# Altium schematic sheet AUXILIARY POWER.SchDoc
size A3; CheckedBy: Alain.Zhu; CompanyName: TYMPHANY; DrawnBy: Yetta.He; Organization: PABU-BL3; Address1: 11F,block A, CEC building,; Address2: No.2070 Shennan Zhong road,; Address3: Huaqiang North, Futian District,; Address4: Shenzhen,  Guang Dong, P.R.C 518000; DocumentNumber: 4; Revision: 1.0.0; SheetNumber: 4; SheetTotal: 8; Size: A3; PCB By: Yetta.He; Status: DP1.1
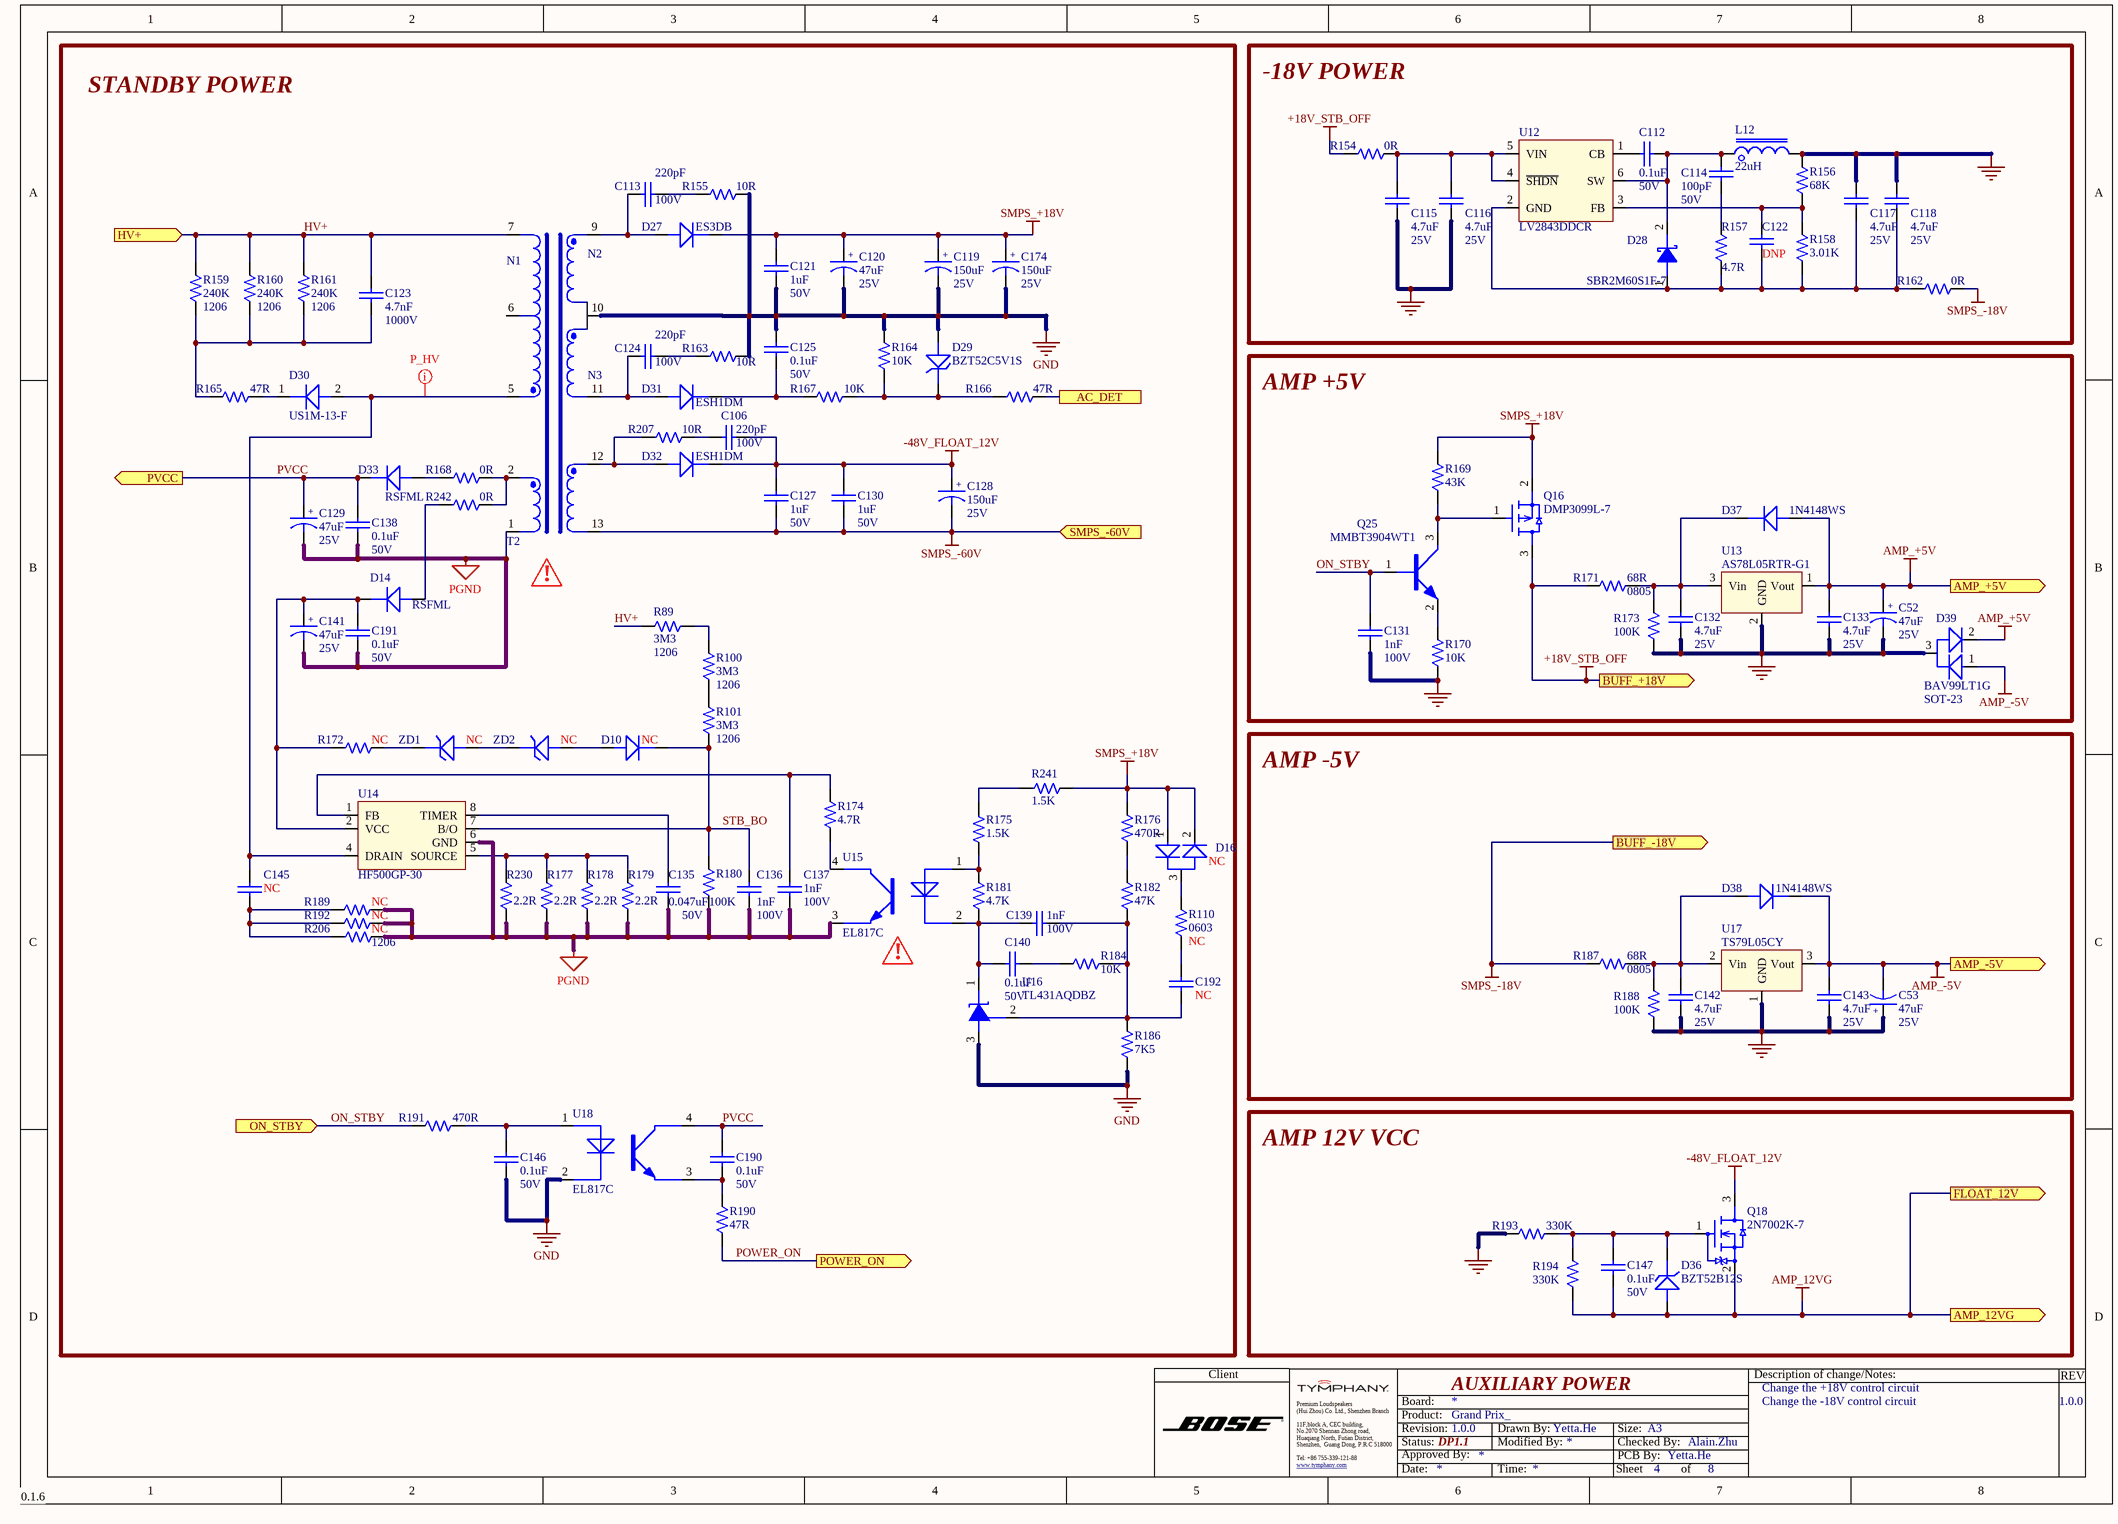
[diagram p0: AUXILIARY POWER.SchDoc]

## Parts
(Parts that share a designator on the sheet are numbered #1, #2 ... from top to bottom, then left to right.)
*?#1  Important Sign  (value not drawn)  (graphical)
*?#2  Important Sign  (value not drawn)  (graphical)
C52  value 47uF  Voltage: 25V  [CASE - D8]  (hidden comment: T551470445040)
C53  value 47uF  Voltage: 25V  [CASE - D8]  (hidden comment: T551470445040)
C106  value 220pF  Voltage: 100V  [CAPC0603-RW]  (hidden comment: PXL4564A0-2210)
C112  value 0.1uF  Voltage: 50V  [CAPC0603-RW]  (hidden comment: PXL456470-1040)
C113  value 220pF  Voltage: 100V  [CAPC0603-RW]  (hidden comment: PXL4564A0-2210)
C114  value 100pF  Voltage: 50V  [CAPC0603-RW]  (hidden comment: PXL410370-1010)
C115  value 4.7uF  Voltage: 25V  [CAPC0603-RW]  (hidden comment: T542024757408)
C116  value 4.7uF  Voltage: 25V  [CAPC0603-RW]  (hidden comment: T542024757408)
C117  value 4.7uF  Voltage: 25V  [CAPC0603-RW]  (hidden comment: T542024757408)
C118  value 4.7uF  Voltage: 25V  [CAPC0603-RW]  (hidden comment: T542024757408)
C119  value 150uF  Voltage: 25V  [CASE - F12]  (hidden comment: T551151445010)
C120  value 47uF  Voltage: 25V  [CASE - D8]  (hidden comment: T551470445040)
C121  value 1uF  Voltage: 50V  [CAPC0603-RW]  (hidden comment: T542021057508)
C122  value DNP  [CAPC0603-RW]  (hidden comment: CAP0603 NC)
C123  value 4.7nF  Voltage: 1000V  [CAPC1206-RW]  (hidden comment: PZL4564Q0-4720)
C124  value 220pF  Voltage: 100V  [CAPC0603-RW]  (hidden comment: PXL4564A0-2210)
C125  value 0.1uF  Voltage: 50V  [CAPC0603-RW]  (hidden comment: PXL456470-1040)
C127  value 1uF  Voltage: 50V  [CAPC0603-RW]  (hidden comment: T542021057508)
C128  value 150uF  Voltage: 25V  [CASE - F12]  (hidden comment: T551151445010)
C129  value 47uF  Voltage: 25V  [CASE - D8]  (hidden comment: T551470445040)
C130  value 1uF  Voltage: 50V  [CAPC0603-RW]  (hidden comment: T542021057508)
C131  value 1nF  Voltage: 100V  [CAPC0603-RW]  (hidden comment: PXL4564A2-1020)
C132  value 4.7uF  Voltage: 25V  [CAPC0603-RW]  (hidden comment: T542024757408)
C133  value 4.7uF  Voltage: 25V  [CAPC0603-RW]  (hidden comment: T542024757408)
C135  value 0.047uF  Voltage: 50V  [CAPC0603-RW]  (hidden comment: T54202473750)
C136  value 1nF  Voltage: 100V  [CAPC0603-RW]  (hidden comment: PXL4564A2-1020)
C137  value 1nF  Voltage: 100V  [CAPC0603-RW]  (hidden comment: PXL4564A2-1020)
C138  value 0.1uF  Voltage: 50V  [CAPC0603-RW]  (hidden comment: PXL456470-1040)
C139  value 1nF  Voltage: 100V  [CAPC0603-RW]  (hidden comment: PXL4564A2-1020)
C140  value 0.1uF  Voltage: 50V  [CAPC0603-RW]  (hidden comment: PXL456470-1040)
C141  value 47uF  Voltage: 25V  [CASE - D8]  (hidden comment: T551470445040)
C142  value 4.7uF  Voltage: 25V  [CAPC0603-RW]  (hidden comment: T542024757408)
C143  value 4.7uF  Voltage: 25V  [CAPC0603-RW]  (hidden comment: T542024757408)
C145  value NC  [CAPC1206-RW]  (hidden comment: PZL4564Q0-4720)
C146  value 0.1uF  Voltage: 50V  [CAPC0603-RW]  (hidden comment: PXL456470-1040)
C147  value 0.1uF  Voltage: 50V  [CAPC0603-RW]  (hidden comment: PXL456470-1040)
C174  value 150uF  Voltage: 25V  [CASE - F12]  (hidden comment: T551151445010)
C190  value 0.1uF  Voltage: 50V  [CAPC0603-RW]  (hidden comment: PXL456470-1040)
C191  value 0.1uF  Voltage: 50V  [CAPC0603-RW]  (hidden comment: PXL456470-1040)
C192  value NC  [CAPC0603-RW]  (hidden comment: CAP0603 NC)
D10  MFG Part: NC  [SOD-323]  (hidden comment: RCD114148-0020)
D14  MFG Part: RSFML  [subSMA]  (hidden comment: T571002670204)
D16  MFG Part: NC  [SOT23-132-RW]  (hidden comment: RCD100099-0010)
D27  MFG Part: ES3DB  [SMB]  (hidden comment: DIO ES3DB)
D28  MFG Part: SBR2M60S1F-7  [SOD-123]  (hidden comment: T572006161416)
D29  MFG Part: BZT52C5V1S  [SOD-323]  (hidden comment: T573004470941)
D30  RCD100010-0030  [SMA(DO-214AC)]  (value not drawn)
D31  T571002680204  [Micro SMA]  (value not drawn)
D32  T571002680204  [Micro SMA]  (value not drawn)
D33  MFG Part: RSFML  [subSMA]  (hidden comment: T571002670204)
D36  MFG Part: BZT52B12S  [SOD-323]  (hidden comment: T573004460941)
D37  RCD114148-0020  [SOD-323]  (value not drawn)
D38  RCD114148-0020  [SOD-323]  (value not drawn)
D39  Package: SOT-23  [SOT23-132-RW]  (hidden comment: RCD100099-0010)
L12  value 22uH  [IND CKST0505]  (hidden comment: T621000054100)
Q16  T585002550438  [SOT23-132-RW]  (value not drawn)
Q18  T586003230438  [SOT23-132-RW]  (value not drawn)
Q25  T581003992440  [SOT323(SC-70)-R]  (value not drawn)
R89  value 3M3  PACKAGE: 1206  [1206-RW]  (hidden comment: T502330404399)
R100  value 3M3  PACKAGE: 1206  [1206-RW]  (hidden comment: T502330404399)
R101  value 3M3  PACKAGE: 1206  [1206-RW]  (hidden comment: T502330404399)
R110  value NC  Package: 0603  [0603-RW]  (hidden comment: RES0603 NC)
R154  value 0R  [0805-RW]  (hidden comment: T502000003009)
R155  value 10R  [0603-RW]  (hidden comment: QCF011030-1009)
R156  value 68K  [0603-RW]  (hidden comment: QCF011030-6802)
R157  value 4.7R  [0603-RW]  (hidden comment: QCF011030-4708)
R158  value 3.01K  [0603-RW]  (hidden comment: QCF011030-3011)
R159  value 240K  PACKAGE: 1206  [1206-RW]  (hidden comment: T502240304399)
R160  value 240K  PACKAGE: 1206  [1206-RW]  (hidden comment: T502240304399)
R161  value 240K  PACKAGE: 1206  [1206-RW]  (hidden comment: T502240304399)
R162  value 0R  [0805-RW]  (hidden comment: T502000003009)
R163  value 10R  [0603-RW]  (hidden comment: QCF011030-1009)
R164  value 10K  [0603-RW]  (hidden comment: QCF011030-1002)
R165  value 47R  [0805-RW]  (hidden comment: QCF081020-4709)
R166  value 47R  [0603-RW]  (hidden comment: QCF011030-4709)
R167  value 10K  [0603-RW]  (hidden comment: QCF011030-1002)
R168  value 0R  [0805-RW]  (hidden comment: T502000003009)
R169  value 43K  [0603-RW]  (hidden comment: QCF011031-4302)
R170  value 10K  [0603-RW]  (hidden comment: QCF011030-1002)
R171  value 68R  PACKAGE: 0805  [0805-RW]  (hidden comment: QCF081020-6809)
R172  value NC  [0603-RW]  (hidden comment: RES0603 NC)
R173  value 100K  [0603-RW]  (hidden comment: QCF011030-1003)
R174  value 4.7R  [0805-RW]  (hidden comment: QCF081020-4708)
R175  value 1.5K  [0603-RW]  (hidden comment: QCF011030-1501)
R176  value 470R  [0603-RW]  (hidden comment: QCF011030-4700)
R177  value 2.2R  [0805-RW]  (hidden comment: QCF081020-2208)
R178  value 2.2R  [0805-RW]  (hidden comment: QCF081020-2208)
R179  value 2.2R  [0805-RW]  (hidden comment: QCF081020-2208)
R180  value 100K  [0603-RW]  (hidden comment: QCF011030-1003)
R181  value 4.7K  [0603-RW]  (hidden comment: QCF011030-4701)
R182  value 47K  [0603-RW]  (hidden comment: QCF011030-4702)
R184  value 10K  [0603-RW]  (hidden comment: QCF011030-1002)
R186  value 7K5  [0603-RW]  (hidden comment: QCF011030-7501)
R187  value 68R  PACKAGE: 0805  [0805-RW]  (hidden comment: QCF081020-6809)
R188  value 100K  [0603-RW]  (hidden comment: QCF011030-1003)
R189  value NC  [1206-RW]  (hidden comment: QCF041010-4709)
R190  value 47R  [0603-RW]  (hidden comment: QCF011030-4709)
R191  value 470R  [0603-RW]  (hidden comment: QCF011030-4700)
R192  value NC  [1206-RW]  (hidden comment: QCF041010-4709)
R193  value 330K  [0603-RW]  (hidden comment: QCF011030-3303)
R194  value 330K  [0603-RW]  (hidden comment: QCF011030-3303)
R206  value NC  PACKAGE: 1206  [1206-RW]  (hidden comment: QCF041010-4709)
R207  value 10R  [0603-RW]  (hidden comment: QCF011030-1009)
R230  value 2.2R  [0805-RW]  (hidden comment: QCF081020-2208)
R241  value 1.5K  [0603-RW]  (hidden comment: QCF011030-1501)
R242  value 0R  [0805-RW]  (hidden comment: T502000003009)
T2  TRANS HTS-EEL25A  [HTS-EEL25A]  (value not drawn)
U12  MFG Part: LV2843DDCR  [DBV(R-PDSO-G6)]  (hidden comment: RCI002843-0001)
U13  T610600095267  [SOT89]  (value not drawn)
U14  HF500GP-30  [DIP-8C]
U15  MFG Part: EL817C  [EL817-S1]  (hidden comment: RCI000817-0001)
U16  MFG Part: TL431AQDBZ  [SOT23-132-RW]  (hidden comment: T610600097805)
U17  T610600095171  [SOT89]  (value not drawn)
U18  MFG Part: EL817C  [EL817-S1]  (hidden comment: RCI000817-0001)
ZD1  MFG Part: NC  [SOD-323]  (hidden comment: T573004530741)
ZD2  MFG Part: NC  [SOD-323]  (hidden comment: T573004530741)

## Blocks framed on the sheet
STANDBY POWER: *?#1 *?#2 C106 C113 C119-C121 C123-C125 C127-C130 C135-C141 C145 C146 C174 C190-C192 D10 D14 D16 D27 D29-D33 R89 R100 R101 R110 R155 R159-R161 R163-R168 R172 R174-R182 R184 R186 R189-R192 R206 R207 R230 R241 R242 T2 U14-U16 U18 ZD1 ZD2
-18V POWER: C112 C114-C118 C122 D28 L12 R154 R156-R158 R162 U12
AMP +5V: C52 C131-C133 D37 D39 Q16 Q25 R169-R171 R173 U13
AMP -5V: C53 C142 C143 D38 R187 R188 U17
AMP 12V VCC: C147 D36 Q18 R193 R194

## Ports
AC_DET, AMP_12VG (out), AMP_+5V (out), AMP_-5V (out), BUFF_+18V (out), BUFF_-18V (out), FLOAT_12V (out), HV+ (in), ON_STBY (in), POWER_ON (out), PVCC (out), SMPS_-60V (in)

## Nets
+18V_STB_OFF: Q16.3(D) R154.1 R171.2 ; port BUFF_+18V
-48V_FLOAT_12V: C106.1 C127.1 C128.1 C130.1 D32.2(K) Q18.3(D)
AMP_12VG: C147.2 D36.1(A) Q18.2(S) R194.1 ; port AMP_12VG, port FLOAT_12V
AMP_+5V: C52.1 C133.1 D37.1(A) D39.2(A) U13.1(Vout) ; port AMP_+5V
AMP_-5V: C53.2 C143.1 D38.2(K) D39.1(A) U17.3(Vout) ; port AMP_-5V
GND: C52.2 C53.1 C115.2 C116.2 C117.1 C118.1 C119.2 C120.2 C121.2 C125.1 C131.2 C132.2 C133.2 C142.2 C143.2 C146.2 C174.2 D29.1(A) D39.3(K) L12.2 R155.2 R156.2 R163.2 R164.2 R170.1 R173.1 R186.1 R188.1 R193.2 T2.10 U13.2(GND) U16.3(A) U17.1(GND) U18.2(E)
PGND: C129.2 C135.2 C136.2 C137.2 C138.2 C141.2 C191.2 R177.1 R178.1 R179.1 R180.1 R189.1 R192.1 R206.2 R230.1 T2.1 U14.6(GND) U15.3(C)
SMPS_+18V: C119.1 C120.1 C121.1 C174.1 D16.1(A) D16.2(A) D27.2(K) Q16.2(S) R169.2 R176.2 R241.2
SMPS_-18V: R162.2 R187.2 ; port BUFF_-18V
SMPS_-60V: C127.2 C128.2 C130.2 T2.13 ; port SMPS_-60V
AC_DET: R166.2 ; port AC_DET
HV+: C123.1 R89.2 R159.2 R160.2 R161.2 T2.7 ; port HV+
ON_STBY: C131.1 Q25.1(B) R191.2 ; port ON_STBY
POWER_ON: R190.1 ; port POWER_ON
PVCC: C129.1 C138.1 C190.1 D33.2(K) U18.4(C) ; port PVCC
STB_BO: C136.1 D10.2(K) R101.1 R180.2 U14.7(B/O)
NetC106_2: C106.2 R207.2
NetC112_1: C112.1 U12.1(CB)
NetC112_2: C112.2 C114.2 D28.2(K) L12.1 U12.6(SW)
NetC113_1: C113.1 R155.1
NetC113_2: C113.2 D27.1(A) T2.9
NetC114_1: C114.1 R157.2
NetC115_1: C115.1 C116.1 R154.2 U12.4(~{SHDN}) U12.5(VIN)
NetC117_2: C117.2 C118.2 C122.2 D28.1(A) R157.1 R158.1 R162.1 U12.2(GND)
NetC122_1: C122.1 R156.1 R158.2 U12.3(FB)
NetC123_2: C123.2 R159.1 R160.1 R161.1 R165.2
NetC124_1: C124.1 R163.1
NetC124_2: C124.2 D31.1(A) T2.11
NetC125_2: C125.2 D31.2(K) R167.2
NetC132_1: C132.1 D37.2(K) R171.1 R173.2 U13.3(Vin)
NetC135_1: C135.1 U14.8(TIMER)
NetC137_1: C137.1 R174.2 U14.1(FB)
NetC139_1: C139.1 C140.1 R181.1 U15.2(E) U16.1(K)
NetC139_2: C139.2 C192.2 R182.1 R184.1 R186.2 U16.2(R)
NetC140_2: C140.2 R184.2
NetC141_1: C141.1 C191.1 D14.2(K) R172.1 U14.2(VCC)
NetC142_1: C142.1 D38.1(A) R187.1 R188.2 U17.2(Vin)
NetC145_1: C145.1 R189.2 R192.2 R206.1
NetC145_2: C145.2 D30.2(K) T2.5 U14.4(DRAIN)
NetC146_1: C146.1 R191.1 U18.1(B)
NetC147_1: C147.1 D36.2(K) Q18.1(G) R193.1 R194.2
NetC190_2: C190.2 R190.2 U18.3(C)
NetC192_1: C192.1 R110.1
NetD10_1: D10.1(A) ZD2.1(A)
NetD14_1: D14.1(A) R242.1
NetD16_3: D16.3(K) R110.2
NetD29_2: D29.2(K) R164.1 R166.1 R167.1
NetD30_1: D30.1(A) R165.1
NetD32_1: D32.1(A) R207.1 T2.12
NetD33_1: D33.1(A) R168.1
NetQ16_1: Q16.1(G) Q25.3(C) R169.1
NetQ25_2: Q25.2(E) R170.2
NetR89_1: R89.1 R100.2
NetR100_1: R100.1 R101.2
NetR168_2: R168.2 R242.2 T2.2
NetR172_2: R172.2 ZD1.2(K)
NetR174_1: R174.1 U15.4(C)
NetR175_1: R175.1 R241.1
NetR175_2: R175.2 R181.2 U15.1(B)
NetR176_1: R176.1 R182.2
NetR177_2: R177.2 R178.2 R179.2 R230.2 U14.5(SOURCE)
NetZD1_1: ZD1.1(A) ZD2.2(K)

Not connected (* = marked no-connect by the designer): T2 6

## Layout directives
net class P_HV: NetC145_2

## Notes on the sheet
- AUXILIARY POWER
- Change the +18V control circuit
- Change the -18V control circuit
- 0.1.6
- Client
- Description of change/Notes:
- REV
- Premium Loudspeakers
- (Hui Zhou) Co. Ltd., Shenzhen Branch
- Tel: +86 755-339-121-88
- Board:
- Status:
- Revision:
- Product:
- Approved By:
- Grand Prix_
- Drawn By:
- Modified By:
- Checked By:
- PCB By:
- Size:
- www.tymphany.com <http://www.tymphany.com>
- Date:
- Time:
- Sheet
- of
- (in symbol CAP E 47UF 25V +-20%_OVK470M1ETR-0608CS) +
- (in symbol CAP E 150UF 25V +-20%_OVK151M1ETR-0812CS) +
- (in symbol Important Sign) !
- (in symbol TRANS HTS-EEL25A) N2; N1; N3

## Library data of the parts
C52 C53 C120 C129 C141 = CAP E 47UF 25V +-20%_OVK470M1ETR-0608CS: E 47UF 25V +-20% 6X8MM OVK470M1E K; MFG: LELON; Tolerance: 20%; Type: Capacitor; CREATE_NAME: Cherry; DIP&SMD: SMD; SAP: T551470445040; PACKAGE: CASE - C7.7; Vendor Name: *; Vendor Code: *; MFG Part: OVK470M1ETR-0608CS; Other: *; CREATE_TIME: 2019-04-02; Customer Specific: N/A
C106 C113 C124 = CAP0603 220pF 100V 10%: CHIP CAP 220pF 100V 10%; SAP: T542022217608; Vendor Code: 10010262; Vendor Name: 东莞市晴远电子有限公司; Type: Capacitor; DIP&SMD: SMD; PACKAGE: CAPC0603; MFG: *; MFG Part: *; Other: *; Tolerance: 10%; Customer Specific: N/A
C112 C125 C138 C140 C146 C147 C190 C191 = CAP0603 0.1uF 50V 10% - PXL456470-1040: GP CHIP CAP 0.1uF 50V 10% 0603 TYPE X7R; SAP: T542021047508; Vendor Code: 10010262; Vendor Name: 东莞市晴远电子有限公司; Type: Capacitor; DIP&SMD: SMD; PACKAGE: CAPC0603; MFG: *; MFG Part: *; Other: X7R; Tolerance: 10%; Customer Specific: N/A
C114 = CAP0603 100pF 50V 5% - PXL410370-1010: GP CHIP CAP 100pF 50V 5% 0603 TYPE NPO; SAP: T541021016508; Vendor Code: 10010262; Vendor Name: 东莞市晴远电子有限公司; Type: Capacitor; DIP&SMD: SMD; PACKAGE: CAPC0603; MFG: *; MFG Part: *; Other: NPO; Tolerance: 5%; Customer Specific: N/A
C115-C118 C132 C133 C142 C143 = CAP0603 4.7uF 25V 10%_X7R_WALSIN: CAP X7R 4.7UF 25V +-10% 0603 WALSIN L; Tolerance: 10%; Type: Capacitor; CREATE_NAME: Nathan; DIP&SMD: SMD; SAP: T542024757408; PACKAGE: CAPC0603; Vendor Name: *; MFG: WALSIN; MFG Part: *; Other: X7R; CREATE_TIME: 13-July-2016; Customer Specific: N/A
C119 C128 C174 = CAP E 150UF 25V +-20%_OVK151M1ETR-0812CS: E 150UF 25V +-20% 8X12MM OVK151M1E K; MFG: lelon; Tolerance: 20%; Type: Capacitor; DIP&SMD: SMD; CREATE NAME: Cherry; SAP: T551151445010; PACKAGE: CASE - F12; Vendor Name: *; Vendor Code: *; MFG Part: OVK151M1ETR-0812CS; Other: *; Customer Specific: N/A; CREATE TIME: 2019-04-02
C121 = CAP0603 1uF 50V 10%_X7R_WALSIN: CAP X7R 1.0UF 50V +-10% 0603 WALSIN L; Tolerance: 10%; Type: Capacitor; CREATE_NAME: Nathan; DIP&SMD: SMD; SAP: T542021057508; PACKAGE: CAPC0603; Vendor Name: *; MFG: WALSIN; MFG Part: *; Other: X7R; CREATE_TIME: 13-July-2016; Customer Specific: N/A
C122 C192 = CAP0603 NC: NC; Type: Capacitor; CREATE_NAME: Tom; DIP&SMD: SMD; SAP: *; PACKAGE: CAPC0603; Vendor Code: *; Vendor Name: *; MFG: *; MFG Part: *; Other: *; Tolerance: *; CREATE_TIME: 18-Mar-2016; Voltage: *; Customer Specific: N/A
C123 C145 = CAP1206 4.7nF 1000V 10%: CHIP CAP 4.7nF 1000V 10% 1206; SAP: T542044727H08; Vendor Code: 10010262; Vendor Name: ¶«Ý¸ÊÐÇçÔ¶µç×ÓÓÐÏÞ¹«Ë¾; Type: Capacitor; DIP&SMD: SMD; PACKAGE: CAPC1206; MFG: *; MFG Part: *; Other: *; Tolerance: 10%; Customer Specific: N/A
  C145: Voltage: 1000V
C127 C130 = CAP0603 1uF 50V 10%_X7R_WALSIN: CAP X7R 1.0UF 50V +-10% 0603 WALSIN L; Tolerance: 10%; Type: Capacitor; DIP&SMD: SMD; CREATE_NAME: Nathan; SAP: T542021057508; PACKAGE: CAPC0603; Vendor Name: *; MFG: WALSIN; MFG Part: *; Other: X7R; Customer Specific: N/A; CREATE_TIME: 13-July-2016
C131 C136 C137 C139 = CAP0603 1nF 100V 10% - PXL4564A2-1020: CHIP CAP 1nF 100V 10%; SAP: T542021027608; Vendor Code: 10010262; Vendor Name: 东莞市晴远电子有限公司; Type: Capacitor; DIP&SMD: SMD; PACKAGE: CAPC0603; MFG: *; MFG Part: *; Other: *; Tolerance: 10%; Customer Specific: N/A
C135 = CAP0603 0.047uF 50V 10%_X7R_SAMSUNG: CAP X7R .047U 50V +-10% 0603 SAMSUN L; SAP: T542024737508; Tolerance: 10%; Type: Capacitor; CREATE_NAME: Nathan; DIP&SMD: SMD; PACKAGE: CAPC0603; Vendor Code: *; Vendor Name: *; MFG: SAMSUNG; MFG Part: *; Other: X7R; CREATE_TIME: 02-Aug-2016; Customer Specific: N/A
D10 D37 D38 = 1N4148WS: DIODE SW 1N4148 VF=0.7V SOD-323; MFG: TW SEMICONDUCTOR; SAP: T572005070208; Voltage: 100V; Current: 150MA; DIP&SMD: SMD; Vendor Name: *; Vendor Code: *; Type: DIODE; Customer Specific: N/A; Package: SOD-323
  D37 D38: MFG Part: 1N4148WS
D14 D33 = DIO RSFML: DIODE 1000 0.8A RSFML TSC K; MFG: TSC    (台灣半導體); Voltage: 1000V; CREATE_NAME: Tom; DIP&SMD: SMD; SAP: T571002670204; Current: 0.8A; Type: DIODE; CREATE_TIME: 25-Nov-2016; Package: sub-SMA; Customer Specific: N/A
D16 D39 = BAV99LT1G: SWITC 70V 215MA BAV99LT1G ON SE G; SAP: T572003550122; MFG: ON SEMI; Voltage: 100V; Power: 225MW; Type: DIODE; DIP&SMD: SMD; Vendor Code: *; Vendor Name: *; Current: 215mA; Customer Specific: N/A
  D16: Package: SOT-23
  D39: MFG Part: BAV99LT1G
D27 = DIO ES3DB: CHIP DIODE DO-214AA(SMB) ES3DB; MFG: TW SEMICONDUCTOR; SAP: T570000980812; I fsm: 100A; CREATE_NAME: Nathan; DIP&SMD: SMD; I f(av): 3A; Vendor Name: *; Vendor Code: *; Type: DIODE; Package: DO-214AA(SMB); CREATE_TIME: 07-Nov-2018; Customer Specific: N/A
D28 = DIO SBR2M60S1F-7: SWITC 0.7V 2A SBR2M60S1F-7 DIODE L; MFG: DIODES; Voltage: 50V; Current: 5.0A; DIP&SMD: SMD; CREATE_NAME: Nathan; SAP: T572006161416; Vendor Name: *; Vendor Code: *; Type: DIODE; Customer Specific: N/A; Package: SOD123F; CREATE_TIME: 16-Mar-2017
D29 = BZT52C5V1S_TSC: ZD 5.1V 200MW ±5% SMD TSC ( K; MFG: TSC (TAIWAN SEMICONDUCTOR); VOLTAGE: 5V1; Type: ZENER; CREATE_NAME: Nathan; SAP: T573004470941; Vendor Code: *; Vendor Name: *; Current: *; Tolerance: 5%; Power: 200MW; DIP&SMD: SMD; Customer Specific: N/A; Package: SOD-323F; CREATE_TIME: 15-Mar-2019
D30 = US1M-13-F: DIODE 1000 1.0A US1M-13-F DIODE K; MFG: DIODES  (ZETEX); SAP: T571002110230; DIP&SMD: SMD; CREATE_NAME: Nathan; Voltage: *; Type: DIODE; Customer Specific: N/A; MFG Part: US1M-13-F; CREATE_TIME: 10-Aug-2017
D31 = ESH1DM: DIODE 200V 1.0A ESH1DM TSC G; Current: 1A; CREATE_NAME: Tom; MFG: TSC; SAP: T571002680204; Vendor Name: *; Vendor Code: *; Voltage: 200V; Type: DIODE; CREATE_TIME: 19-Jul-2016; Package: Micro SMA; MFG Part: ESH1DM
D32 = ESH1DM: DIODE 200V 1.0A ESH1DM TSC G; Current: 1A; CREATE_NAME: Tom; DIP&SMD: SMD; MFG: TSC; SAP: T571002680204; Vendor Name: *; Vendor Code: *; Voltage: 200V; Type: DIODE; CREATE_TIME: 19-Jul-2016; Package: Micro SMA; Customer Specific: N/A; MFG Part: ESH1DM
D36 = BZT52B12S_TSC: ZD 12V 200MW ±2% SMD TSC ( K; MFG: TSC (TAIWAN SEMICONDUCTOR); Type: ZENER; CREATE_NAME: Nathan; SAP: T573004460941; Vendor Code: *; Vendor Name: *; Current: *; Tolerance: 2%; Power: 200MW; VOLTAGE: 12V; Package: SOD-323F; CREATE_TIME: 15-Mar-2019; DIP&SMD: SMD; Customer Specific: N/A
L12 = IND 22uH CKST0505-22UH\M: 22UH 2 5A 100K 5.7X CENKER CKST050 K; Type: INDUCTOR; CREATE_NAME: Nathan; Irms: 1.5A; DCR: 238mΩ; Isat: 2.5A; DIP&SMD: SMD; SAP: T621000054100; MFG: CENKER; Vendor Code: *; Vendor Name: *; CREATE_TIME: 27-Dec-2017; MFG Part: CKST0505-22UH\M
Q16 = DMP3099L-7: PMOS 20V DMP3099L-7 SOT23 DIODES K; MFG: DIODES  (ZETEX); CREATE_NAME: Nathan; DIP&SMD: SMD; SAP: T585002550438; Vendor Code: *; Vendor Name: *; Power: *; Voltage: *; Type: PMOS; Package: SOT-23; CREATE_TIME: 25-Nov-2018; Customer Specific: N/A; MFG Part: DMP3099L-7
Q18 = 2N7002K-7: NMOS 60V 2N7002K-7 SOT23 DIODES K; MFG: DIODES  (ZETEX); Type: N-CHANNEL MOSFET; CREATE_NAME: Nathan; DIP&SMD: SMD; SAP: T586003230438; Power: *; Vendor Code: *; Vendor Name: *; Voltage: 60V; CREATE_TIME: 27-Sep-2018; Customer Specific: N/A; Package: SOT-23; MFG Part: 2N7002K-7
Q25 = MMBT3904WT1: NPN 40V MMBT3904WT1 SC70 ( ON K; CREATE_NAME: Nathan; DIP&SMD: SMD; SAP: T581003992440; MFG: ON; Vendor Code: *; Vendor Name: *; Voltage: *; Type: NPN; CREATE_TIME: 17-Oct-2017; Current: *; Customer Specific: N/A; MFG Part: MMBT3904WT1
R89 R100 R101 = RES1206 1/4W 1% 3.3M OHM_WALSIN: CHIP 3.3M OHM  100PPM +-1% 1206 WALS L; Power: 1/4W; MFG: WALSIN (華新); TOL: 1%; CREATE_NAME: Nathan; DIP&SMD: SMD; Vendor Code: *; SAP: T502330404399; Vendor Name: *; MFG Part: *; Type: Resistor; CREATE_TIME: 03-July-2016; Customer Specific: N/A
R110 R172 = RES0603 NC: NC; CREATE_NAME: Tom; DIP&SMD: SMD; SAP: *; Tolerance: *; MFG Part: *; MFG: *; Vendor Code: *; Vendor Name: *; Type: Resistor; Power: *; CREATE_TIME: 18-Mar-2016; Customer Specific: N/A
  R172: Package: 0603
R154 R162 R168 R242 = RES0805 1/8W  0 OHM_WALSIN: CHIP 0 OHM 0 OHM 0 OHM 0805 WALSI L; Power: 1/8W; MFG: WALSIN; CREATE_Name: Tom; DIP&SMD: SMD; Vendor Code: *; SAP: T502000003009; Vendor Name: *; MFG Part: *; TOL: *; Type: Resistor; CREATE_Time: 27-Jun-2018; PACKAGE: 0805; Customer Specific: N/A
R155 R163 R207 = RES0603 1/10W 1% 10 OHM: CHIP 10 OHM 100PPM +-1% 0603 WALS L; Vendor Code: 10010262; SAP: T502100A02399; Power: 1/10W; Vendor Name: 东莞市晴远电子有限公司; MFG: WALSIN (華新); TOL: 1%; DIP&SMD: SMD; MFG Part: *; Type: Resistor; PACKAGE: 0603; Customer Specific: N/A
R156 = RES0603 1/10W 1% 68K OHM: GP CHIP RES. 68K OHM 1/10W 1% 0603; Vendor Code: 10010262; SAP: T502680202399; Vendor Name: 东莞市晴远电子有限公司; DIP&SMD: SMD; Power: 1/10W; MFG Part: *; MFG: *; TOL: 1%; Type: Resistor; PACKAGE: 0603; Customer Specific: N/A
R157 = RES0603 1/10W 1% 4.7 OHM: CHIP RES. 4.7 OHM 1/10W 1% 0603; Vendor Code: 10010262; SAP: T502470B02399; Vendor Name: 东莞市晴远电子有限公司; DIP&SMD: SMD; Power: 1/10W; MFG Part: *; MFG: *; TOL: 1%; Type: Resistor; PACKAGE: 0603; Customer Specific: N/A
R158 = RES0603 1/10W 1% 3.01K OHM: CHIP RES 3.01K OHM 1% 1/10W  0603; SAP: T502301102399; CREATE_NAME: TOM@Deftronics; DIP&SMD: SMD; Vendor Code: *; Power: 1/10W; Vendor Name: *; MFG: *; MFG Part: *; TOL: 1%; Type: Resistor; CREATE_TIME: 21-Nov-2013; PACKAGE: 0603; Customer Specific: N/A
R159-R161 = RES1206 1/4W 1% 240K OHM_WALSIN: CHIP 240K OHM  100PPM +-1% 1206 WALS L; Power: 1/4W; MFG: WALSIN (ÈAÐÂ); TOL: 1%; CREATE_NAME: Nathan; DIP&SMD: SMD; Vendor Code: *; SAP: T502240304399; Vendor Name: *; MFG Part: *; Type: Resistor; CREATE_TIME: 03-July-2016; Customer Specific: N/A
R164 R167 = RES0603 1/10W 1% 10K OHM: GP CHIP RES. 10K OHM 1/10W 1% 0603; Vendor Code: 10010262; SAP: T502100202399; Vendor Name: ¶«Ý¸ÊÐÇçÔ¶µç×ÓÓÐÏÞ¹«Ë¾; DIP&SMD: SMD; Power: 1/10W; MFG Part: *; MFG: *; TOL: 1%; Type: Resistor; PACKAGE: 0603; Customer Specific: N/A
R165 = RES0805 1/8W 1% 47 OHM: GP CHIP RES. 47 OHM 1/8W 1% 0805; Vendor Code: 10010262; SAP: T502470A03399; Vendor Name: 东莞市晴远电子有限公司; DIP&SMD: SMD; Power: 1/8W; MFG Part: *; MFG: *; TOL: 1%; Type: Resistor; PACKAGE: 0805; Customer Specific: N/A
R166 R190 = RES0603 1/10W 1% 47 OHM: GP CHIP RES. 47 OHM 1/10W 1% 0603; Vendor Code: 10010262; SAP: T502470A02399; Vendor Name: 东莞市晴远电子有限公司; DIP&SMD: SMD; Power: 1/10W; MFG Part: *; MFG: *; TOL: 1%; Type: Resistor; PACKAGE: 0603; Customer Specific: N/A
R169 = RES0603 1/10W 1% 43K OHM: CHIP RES. 43K OHM 1/10W 1% 0603; Vendor Code: 10010262; SAP: T502430202399; Vendor Name: 东莞市晴远电子有限公司; DIP&SMD: SMD; Power: 1/10W; MFG Part: *; MFG: *; TOL: 1%; Type: Resistor; PACKAGE: 0603; Customer Specific: N/A
R170 R184 = RES0603 1/10W 1% 10K OHM: GP CHIP RES. 10K OHM 1/10W 1% 0603; Vendor Code: 10010262; SAP: T502100202399; Vendor Name: 东莞市晴远电子有限公司; DIP&SMD: SMD; Power: 1/10W; MFG Part: *; MFG: *; TOL: 1%; Type: Resistor; PACKAGE: 0603; Customer Specific: N/A
R171 R187 = RES0805 1/8W 1% 68 OHM: GP CHIP RES. 68 OHM 1/8W 1% 0805; SAP: T502680A03399; MFG: WALSIN; DIP&SMD: SMD; Vendor Code: *; Power: 1/8W; Vendor Name: *; MFG Part: *; TOL: 1%; Type: Resistor
  R187: Customer Specific: N/A
R173 R180 R188 = RES0603 1/10W 1% 100K OHM: GP CHIP RES. 100K OHM 1/10W 1% 0603; Vendor Code: 10010262; SAP: T502100302399; Vendor Name: 东莞市晴远电子有限公司; DIP&SMD: SMD; Power: 1/10W; MFG Part: *; MFG: *; TOL: 1%; Type: Resistor; PACKAGE: 0603
  R180: Customer Specific: N/A
R174 = RES0805 1/8W 1% 4.7 OHM: GP CHIP RES 4.7 OHM 1/8W 1% 0805; Vendor Code: 10010262; SAP: T502470B03399; Vendor Name: 东莞市晴远电子有限公司; DIP&SMD: SMD; Power: 1/8W; MFG Part: *; MFG: *; TOL: 1%; Type: Resistor; PACKAGE: 0805; Customer Specific: N/A
R175 R241 = RES0603 1/10W 1% 1.5K OHM: GP CHIP RES. 1.5K OHM 1/10W 1% 0603; Vendor Code: 10010262; SAP: T502150102399; Vendor Name: 东莞市晴远电子有限公司; DIP&SMD: SMD; Power: 1/10W; MFG: *; MFG Part: *; TOL: 1%; Type: Resistor; PACKAGE: 0603; Customer Specific: N/A
R176 R191 = RES0603 1/10W 1% 470 OHM: CHIP RES. 470 OHM 1/10W 1% 0603; Vendor Code: 10010262; SAP: T502470002399; Vendor Name: 东莞市晴远电子有限公司; DIP&SMD: SMD; Power: 1/10W; MFG Part: *; MFG: *; TOL: 1%; Type: Resistor; PACKAGE: 0603; Customer Specific: N/A
R177-R179 R230 = RES0805 1/8W 1% 2.2 OHM: CHIP RES 2.2 OHM 1/8W 1% 0805; Vendor Code: 10010262; SAP: T502220B03399; Vendor Name: 东莞市晴远电子有限公司; DIP&SMD: SMD; Power: 1/8W; MFG Part: *; MFG: *; TOL: 1%; Type: Resistor; PACKAGE: 0805; Customer Specific: N/A
R181 = RES0603 1/10W 1% 4.7K OHM: GP CHIP RES. 4.7K OHM 1/10W 1% 0603; Vendor Code: 10010262; SAP: T502470102399; Vendor Name: 东莞市晴远电子有限公司; DIP&SMD: SMD; Power: 1/10W; MFG: *; MFG Part: *; TOL: 1%; Type: Resistor; PACKAGE: 0603; Customer Specific: N/A
R182 = RES0603 1/10W 1% 47K OHM: GP CHIP RES. 47K OHM 1/10W 1% 0603; Vendor Code: 10010262; SAP: T502470202399; Vendor Name: 东莞市晴远电子有限公司; DIP&SMD: SMD; Power: 1/10W; MFG Part: *; MFG: *; TOL: 1%; Type: Resistor; PACKAGE: 0603; Customer Specific: N/A
R186 = RES0603 1/10W 1% 7.5K OHM: CHIP RES 7.5K OHM 1/10W 1% 0603; Vendor Code: 10010262; SAP: T502750102399; Vendor Name: 东莞市晴远电子有限公司; DIP&SMD: SMD; CREATE_NAME: Nathan; Power: 1/10W; MFG Part: *; MFG: *; TOL: 1%; Type: Resistor; PACKAGE: 0603; Customer Specific: N/A; CREATE_TIME: 26-NOV-2014
R189 R192 R206 = RES1206 1/4W 1% 47 OHM: GP CHIP RES. 47 OHM 1/4  W  1% 1206; Vendor Code: 10010262; SAP: T502470A04399; Vendor Name: 东莞市晴远电子有限公司; Power: 1/4W; DIP&SMD: SMD; MFG Part: *; MFG: *; TOL: 1%; Type: Resistor; Customer Specific: N/A
  R189 R192: PACKAGE: 1206
R193 R194 = RES0603 1/10W 1% 330K OHM: CHIP RES. 330K OHM 1/10W 1% 0603; Vendor Code: 10010262; SAP: T502330302399; Vendor Name: 东莞市晴远电子有限公司; DIP&SMD: SMD; Power: 1/10W; MFG Part: *; MFG: *; TOL: 1%; Type: Resistor; PACKAGE: 0603
U12 = LV2843: REG LV2843 TSOT23-6 TI G; SAP: T610600090405; CREATE_NAME: Nathan; MFG: TI; Vendor Code: *; Vendor Name: *; Package: TSOT-6L; CREATE_TIME: 03-Feb-2015
U13 = AS78L05RTR-G1: REG AS78L05RTR-G1 SOT-89 DIODES K; MFG: DIODES INCORPORATED (BCD); CREAT_NAME: Nathan; DIP&SMD: SMD; SAP: T610600095267; Vendor Code: *; Vendor Name: *; Type: IC; CREAT_TIME: 10-AUG-2017; MFG Part: AS78L05RTR-G1; CREATE_NAME: Nathan; CREATE_TIME: 10-AUG-2017
U14 = HF500GP-30: REG HF500GP-30 PDIP8-7B MPS; SAP: T610000070155; MFG: MPS (MONOLITHIC POWER); CREATE_NAME: Nathan; DIP&SMD: SMD; Vendor Code: *; Vendor Name: *; Type: IC; CREATE_TIME: 28-Sep-2018; Customer Specific: N/A; MFG Part: HF500GP-30
U15 U18 = EL817C-S1: IC 4PIN SMT EL817C  Ever Light; SAP: T58A000491533; Vendor Code: 10020351; Vendor Name: 深圳市卅亿光电有限公司; DIP&SMD: SMD; MFG: Everlight; Type: IC; Customer Specific: N/A
U16 = TL431AQDBZ_TI: REG TL431AQDBZ SOT23-3P TI K; DIP&SMD: SMD; CREATE_NAME: Nathan; SAP: T610600097805; MFG: TI; Vendor Code: *; Vendor Name: *; Type: IC; Customer Specific: N/A; CREATE_TIME: 07-Nov-2018
U17 = TS79L05CY: REG TS79L05CY SOT-89 TSC K; CREAT_NAME: Nathan; DIP&SMD: SMD; SAP: T610600095171; MFG: TSC; Vendor Code: *; Vendor Name: *; Type: IC; CREAT_TIME: 10-AUG-2017; MFG Part: TS79L05CY; CREATE_NAME: Nathan; CREATE_TIME: 10-AUG-2017
ZD1 ZD2 = BZT52C7V5S_TSC: ZD 7.5V 200MW + -5% SOD-32 TSC ( K; MFG: TSC (TAIWAN SEMICONDUCTOR); Tolerance: 5%; VOLTAGE: 7V5; CREATE_NAME: Nathan; DIP&SMD: SMD; SAP: T573004530741; Vendor Code: *; Vendor Name: *; Current: *; Power: 200MW; Type: ZENER; Package: SOD-323 (SC-90/SC-76); CREATE_TIME: 13-May-2019; Customer Specific: N/A